# EAGLE design PCB-MicroAudio (EAGLE 7.7.0)

## Sheet 1 of 2
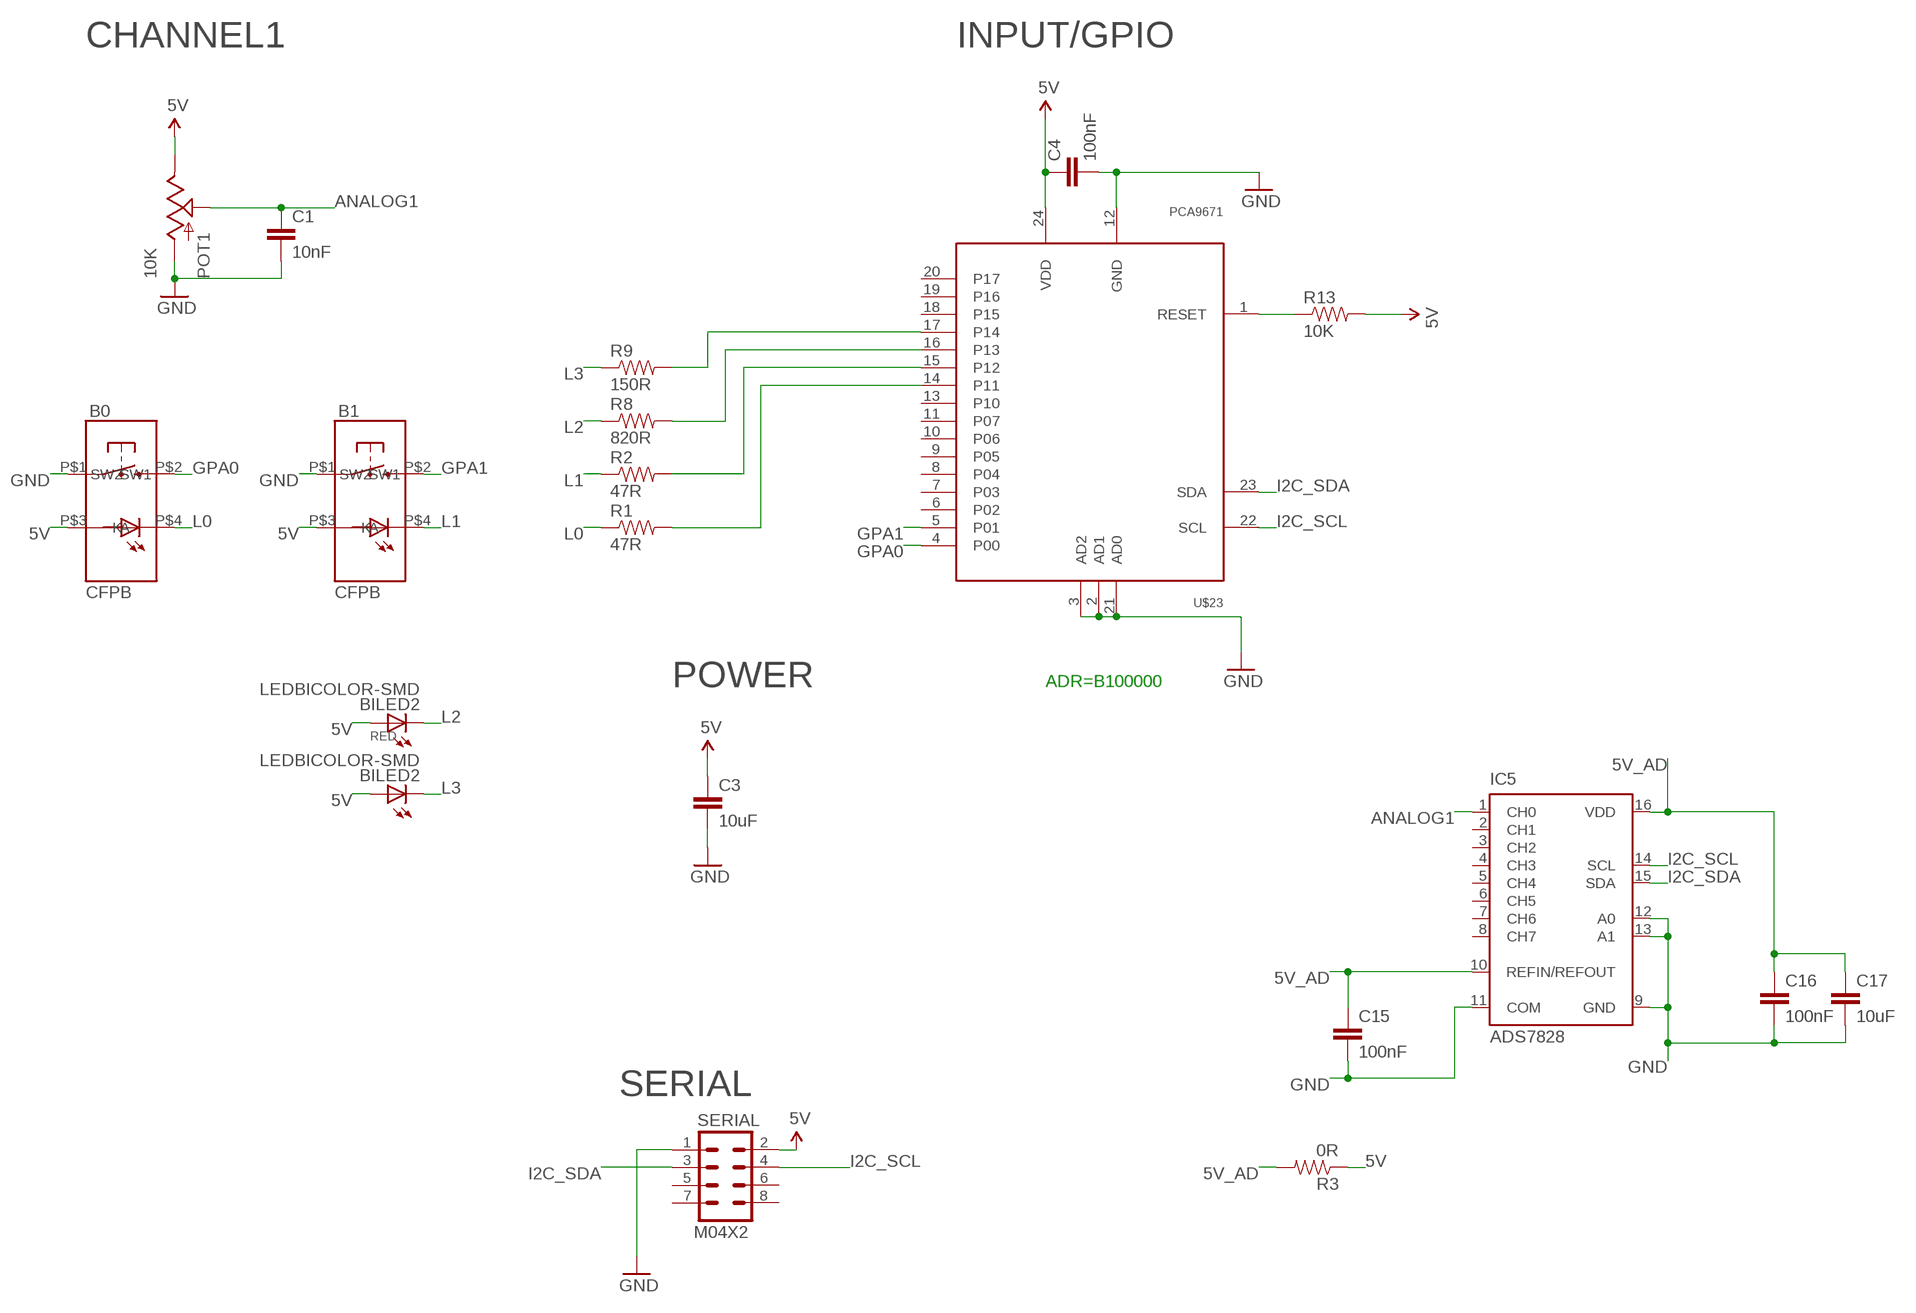
[diagram p0: schematic, sheet 1]

### Parts
B0  CFPB  [CFPB-6/9MM]
B1  CFPB  [CFPB-6/9MM]
BILED2  LEDBICOLOR-SMD  [LEDBICOLOR-SMD]
C1  10nF  CAP0603-CAP  [0603-CAP]
C3  10uF  CAP0805  [0805]
C4  100nF  CAP0603-CAP  [0603-CAP]
C15  100nF  CAP0603-CAP  [0603-CAP]
C16  100nF  CAP0603-CAP  [0603-CAP]
C17  10uF  CAP0805  [0805]
IC5  ADS7828  [TSSOP16-PW]
POT1  10K  POT  [ALPS_POT]
R1  47R  RESISTOR0603-RES  [0603-RES]
R2  47R  RESISTOR0603-RES  [0603-RES]
R3  0R  RESISTOR0603-RES  [0603-RES]
R8  820R  RESISTOR0603-RES  [0603-RES]
R9  150R  RESISTOR0603-RES  [0603-RES]
R13  10K  RESISTOR0603-RES  [0603-RES]
SERIAL  M04X2  [2X4]
U$23  PCA9671  [TSSOP24]

### Nets
5V [Power]: B0.P$3(A) B1.P$3(A) BILED2.P$1(A) BILED2.P$3(A1) C3.1 C4.1 POT1.P$1(E) R3.1 R13.2 SERIAL.2 U$23.24(VDD)
5V_AD [Power]: C15.1 C16.1 C17.1 IC5.10(REFIN/REFOUT) IC5.16(VDD) R3.2
ANALOG1: C1.1 IC5.1(CH0) POT1.P$2(S)
GND [Power]: B0.P$1(SW1) B1.P$1(SW1) C1.2 C3.2 C4.2 C15.2 C16.2 C17.2 IC5.9(GND) IC5.11(COM) IC5.12(A0) IC5.13(A1) POT1.P$3(A) SERIAL.1 U$23.2(AD1) U$23.3(AD2) U$23.12(GND) U$23.21(AD0)
GPA0: B0.P$2(SW2) U$23.4(P00)
GPA1: B1.P$2(SW2) U$23.5(P01)
I2C_SCL: IC5.14(SCL) SERIAL.4 U$23.22(SCL)
I2C_SDA: IC5.15(SDA) SERIAL.3 U$23.23(SDA)
L0: B0.P$4(K) R1.1
L1: B1.P$4(K) R2.1
L2: BILED2.P$2(C) R8.1
L3: BILED2.P$4(C1) R9.1
N$1: R9.2 U$23.17(P14)
N$6: R8.2 U$23.16(P13)
N$10: R2.2 U$23.15(P12)
N$11: R1.2 U$23.14(P11)
N$12: R13.1 U$23.1(RESET)
Unconnected: IC5.2(CH1) IC5.3(CH2) IC5.4(CH3) IC5.5(CH4) IC5.6(CH5) IC5.7(CH6) IC5.8(CH7) SERIAL.5 SERIAL.6 SERIAL.7 SERIAL.8 U$23.6(P02) U$23.7(P03) U$23.8(P04) U$23.9(P05) U$23.10(P06) U$23.11(P07) U$23.13(P10) U$23.18(P15) U$23.19(P16) U$23.20(P17)

### Notes on the sheet
- CHANNEL1 | INPUT/GPIO
- POWER | ADR=B100000
- SERIAL

## Sheet 2 of 2

## Library data of the parts
B0 B1 = SKAARHOJ:CFPB
BILED2 = SKAARHOJ:LEDBICOLOR-SMD
C1 C3 C4 C15-C17 = SparkFun:CAP: Capacitor Standard 0603 ceramic capacitor, and 0.1" leaded capacitor.
IC5 = burr-brown:ADS7828: 12-Bit, 8-Channel Sampling ANALOG-TO-DIGITAL CONVERTER with I2C? Interface Source: www.ti.com .. ADS7828.pdf; MF: TEXAS INSTRUMENTS; MPN: ADS7828E/250; OC_FARNELL: 1470338; OC_NEWARK: 74C7158
POT1 = SparkFun:POT
R1-R3 R8 R9 R13 = SparkFun:RESISTOR: Resistor Basic schematic elements and footprints for 0603, 1206, and PTH resistors.
SERIAL = SparkFun:M04X2
U$23 = SKAARHOJ:PCA9671

## Net classes
0 default: width 0.203 mm, drill 0.406 mm, clearance 0.203 mm
1 Power: width 0.406 mm, drill 0.61 mm, clearance 0.203 mm
2 Signal: width 0.152 mm, clearance 0.152 mm

## Board
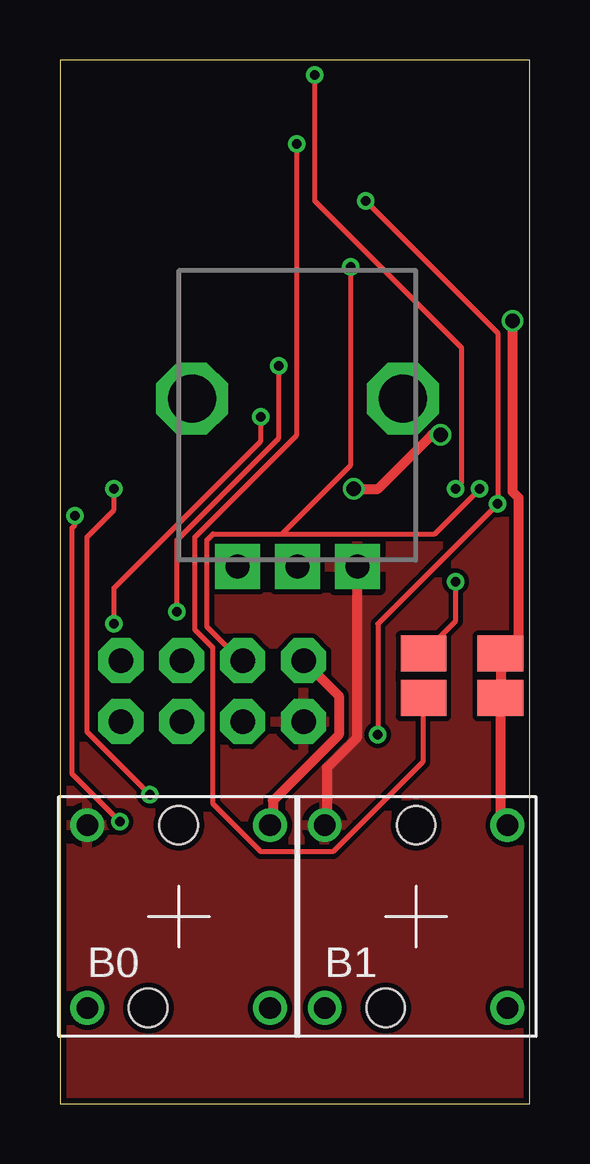
[diagram p1: board, top side]
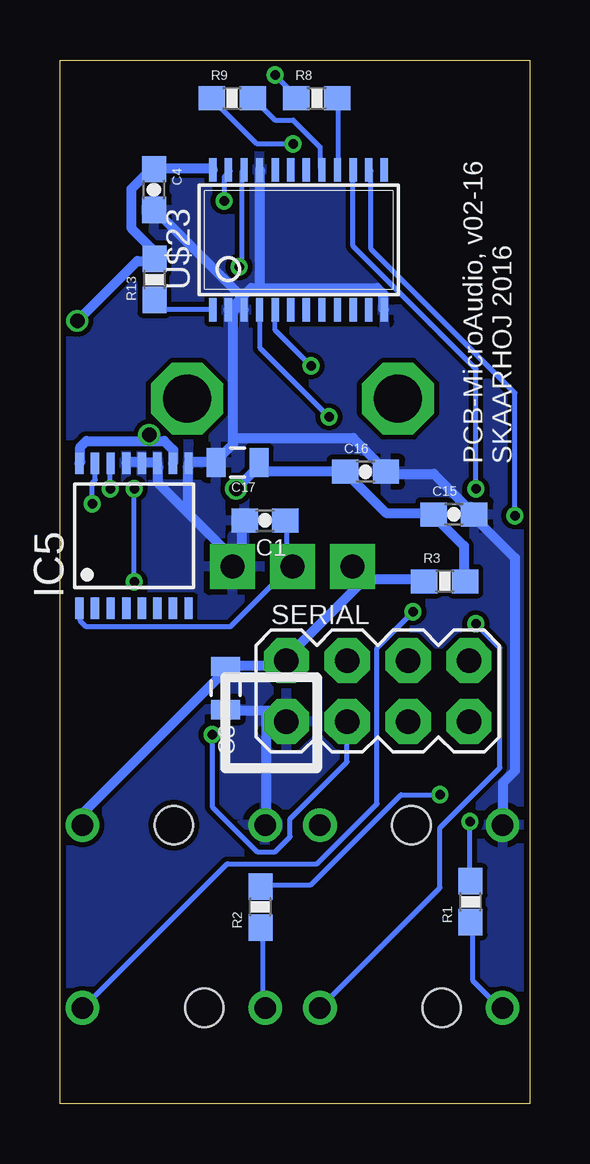
[diagram p2: board, bottom side, seen from below]

Size 19.6 x 43.5 mm. Coordinates in mm from the lower left corner, seen from the top.
Outline: 0,0 19.6,0 19.6,43.5 0,43.5 0,0
Copper layers (1*16): Top 0.035mm / dielectric 1.5mm / Bottom 0.035mm
Design rules "Fusion_eagle_rule_v1.1": minimum track width 6mil, minimum drill 12mil, track to track 6mil, track to pad 6mil, pad to pad 6mil, via to via 6mil, smd to smd 0mil, copper to edge 10mil, drill to drill 10mil, minimum pad ring 10mil, minimum via ring 6mil, stop-mask expansion 2mil, vias tented up to drill 100mil, thermal gap 10mil

### Footprints (pad centres in the part's own frame; a part is rotated, then mirrored left to right if it is on the bottom)
CFPB-6/9MM = drill 0.9: P$1 -3.81,3.81; P$2 3.81,-3.81; P$3 3.81,3.81; P$4 -3.81,-3.81 | hole 1.6: 0,3.81; -1.27,-3.81
LEDBICOLOR-SMD = smd 1.9 x 1.5: P$1 1.6,0.925; P$2 -1.6,0.925; P$3 1.6,-0.925; P$4 -1.6,-0.925
0603-CAP = smd 1.1 x 1: 1 -0.85,0; 2 0.85,0
0805 = smd 0.8 x 1.2: 1 -0.9,0; 2 0.9,0
TSSOP16-PW = smd 0.35 x 0.9: 1 -2.275,-3.025; 2 -1.625,-3.025; 3 -0.975,-3.025; 4 -0.325,-3.025; 5 0.325,-3.025; 6 0.975,-3.025; 7 1.625,-3.025; 8 2.275,-3.025; 9 2.275,3.025; 10 1.625,3.025; 11 0.975,3.025; 12 0.325,3.025; 13 -0.325,3.025; 14 -0.975,3.025; 15 -1.625,3.025; 16 -2.275,3.025
ALPS_POT = drill 1 pad 1.88 square: P$1 7,-2.5; P$2 7,0; P$3 7,2.5 | drill 2 octagon: P$4 0,-4.4; P$5 0,4.4
0603-RES = smd 1.1 x 1: 1 -0.85,0; 2 0.85,0
2X4 = drill 1.016 pad 1.88 octagon: 1 -3.81,-1.27; 2 -3.81,1.27; 3 -1.27,-1.27; 4 -1.27,1.27; 5 1.27,-1.27; 6 1.27,1.27; 7 3.81,-1.27; 8 3.81,1.27
TSSOP24 = smd 0.305 x 0.991: 1 -4.225,-2.918; 2 -3.575,-2.918; 3 -2.925,-2.918; 4 -2.275,-2.918; 5 -1.625,-2.918; 6 -0.975,-2.918; 7 -0.325,-2.918; 8 0.325,-2.918; 9 0.975,-2.918; 10 1.625,-2.918; 11 2.275,-2.918; 12 2.925,-2.918; 13 2.925,2.918; 14 2.275,2.918; 15 1.625,2.918; 16 0.975,2.918; 17 0.325,2.918; 18 -0.325,2.918; 19 -0.975,2.918; 20 -1.625,2.918; 21 -2.275,2.918; 22 -2.925,2.918; 23 -3.575,2.918; 24 -4.225,2.918

### Placement (x,y rotation side)
B0  4.95,7.79 0 top
B1  14.85,7.79 0 top
BILED2  16.76,17.83 0 top
C1  11.05,24.3 180 bottom
C3  12.7,17.32 270 bottom
C4  15.68,38.1 270 bottom
C15  3.17,24.56 0 bottom
C16  6.86,26.34 0 bottom
C17  12.19,26.72 180 bottom
IC5  16.51,23.67 0 bottom
POT1  9.9,29.39 270 top
R1  2.48,8.41 90 bottom
R2  11.24,8.19 90 bottom
R3  3.56,21.77 0 bottom
R8  8.89,41.9 0 bottom
R9  12.41,41.9 0 bottom
R13  15.65,34.35 90 bottom
SERIAL  6.35,17.19 0 bottom
U$23  9,36 0 bottom

### Tracks (layer width: path | path; a pad name or v marks a point on that pad's centre or on a via)
5V  (via drill 0.61)
  Top 0.406: B0.P$3 8.88,11.62 8.88,12.62 11.62,15.38 11.62,17 10.25,18.38 SERIAL.2 | B1.P$3 18.62,11.62 18.38,11.88 18.38,16.75 BILED2.P$3 18.38,17 18.38,18.75 BILED2.P$1 18.5,18.88 19.12,19.5 19.12,25.25 18.88,25.5 v18.88,32.62
  Bottom 0.406: R3.1 4.5,21.88 6.88,21.88 7.38,22.38 POT1.P$1 7,21.75 10.12,18.62 SERIAL.2 10.25,18.38 10.38,18.25 12.62,18.25 C3.1 12.88,18.12 12.88,17.88 18.62,12.12 18.62,11.62 B1.P$3 | U$23.24 13.25,39 15.62,39 C4.1 15.88,38.88 16.62,38.12 16.62,36.5 15.75,35.62 15.75,35.25 R13.2 15.88,35.12 16.38,35.12 v18.88,32.62
5V_AD  (via drill 0.61)
  Top 0.406: v15.88,27.88 15.5,27.88 13.25,25.62 v12.25,25.62
  Bottom 0.406: R3.2 2.75,21.88 2.75,23.25 4,24.5 C15.1 4.12,24.62 6,24.62 7.62,26.25 C16.1 7.75,26.38 11,26.38 11.25,26.62 C17.1 11.38,26.5 v12.25,25.62 | 15.88,27.62 18.5,27.62 18.75,27.38 18.75,26.75 IC5.16 | 15.88,27.62 15.25,27.62 14.88,27.25 14.88,26.75 IC5.10 | v15.88,27.88 15.88,27.62
ANALOG1
  Bottom 0.203: IC5.1 18.75,20.62 18.75,20.12 18.5,19.88 12.5,19.88 10,22.38 POT1.P$2 10.12,22.38 10.12,24.25 C1.1
GND
  Top 0.406: B1.P$1 11.12,11.62 11.12,14 12.38,15.25 12.38,22.38 POT1.P$3
  Bottom 0.406: B0.P$1 1.12,11.62 1.12,13.38 0.62,13.88 0.62,22.75 2.25,24.38 C15.2 2.38,24.62 4,26.25 6,26.25 C16.2 6.12,26.5 7.38,27.75 12.38,27.75 | 11.25,34 11.62,34 12,33.62 | 11.25,34 6.38,34 6.12,33.75 6.12,33.12 U$23.12 | 12.5,33.12 12.25,33.38 | 12.25,33.38 12,33.62 | 12.5,33.12 U$23.2 | U$23.3 12,33.12 12.25,33.38 | 11.25,34 11.25,38.88 U$23.21 | 12,33.62 15.62,37.25 C4.2 | C3.2 12.62,16.38 10.62,16.38 10.25,16 SERIAL.1 11,16.25 11,11.62 B1.P$1 | IC5.13 16.75,26.75 16.38,26.75 IC5.12 16.12,26.75 15.62,26.75 IC5.11 15.5,26.5 15.5,25.88 14.38,24.75 | C1.2 12,24.25 12,22.88 12.38,22.5 POT1.P$3 12.38,22.75 14.38,24.75 | 14.38,24.75 14.25,24.88 14.25,26.5 IC5.9 14.12,26.75 13.12,26.75 C17.2 13,26.88 12.38,27.5 12.38,27.75 | 12.38,27.75 12.38,33 12.5,33.12
  pour Bottom: 0,0 19.81,0 19.81,43.69 0,43.69
  pour Top: 0,0 19.81,0 19.81,43.56 0,43.56
GPA0  (via drill 0.41)
  Top 0.203: v8.38,28.62 8.38,27.62 2.25,21.5 v2.25,20
  Bottom 0.203: v8.38,28.62 11.25,31.5 11.25,33 U$23.4 | v2.25,20 1.25,19 1.25,14 3.75,11.5 3.75,9 8.75,4 B0.P$2
GPA1  (via drill 0.41)
  Top 0.203: v9.12,30.75 9.12,27.75 4.88,23.5 v4.88,20.5
  Bottom 0.203: U$23.5 10.62,32.25 v9.12,30.75 | v4.88,20.5 6.38,19 6.38,12.5 8.88,10 12.62,10 18.62,4 B1.P$2
I2C_SCL  (via drill 0.41)
  Top 0.203: v17.5,25.62 15.62,23.75 9.25,23.75 | 9.25,23.75 6.38,23.75 6.12,23.5 6.12,19.88 7.5,18.5 SERIAL.4 | v12.12,34.88 12.12,26.62 9.25,23.75
  Bottom 0.203: v17.5,25.62 17.5,26.62 IC5.14 | v12.12,34.88 12,35 12,38.88 U$23.22
I2C_SDA  (via drill 0.41)
  Top 0.203: v12.75,37.62 18.25,32.12 v18.25,25 13.25,20 v13.25,15.38
  Bottom 0.203: v18.25,25 18.25,25.88 18.12,26 18.12,26.62 IC5.15 | v12.75,37.62 12.75,38.62 12.5,38.88 U$23.23 | v13.25,15.38 13.25,12.38 11.38,10.5 10.62,10.5 10,11.12 10,11.88 7.62,14.25 7.62,15.88 SERIAL.3
L0
  Bottom 0.203: R1.1 2.38,7.5 2.38,5.12 1.25,4 B0.P$4
L1
  Bottom 0.203: R2.1 11.12,7.25 11.12,4 B1.P$4
L2  (via drill 0.41)
  Top 0.203: v10.62,42.88 10.62,37.62 16.75,31.5 16.75,25.88 v16.5,25.62 | v16.5,21.75 16.5,20.12 15.25,18.88 BILED2.P$2
  Bottom 0.203: v10.62,42.88 9.75,42 R8.1 | v16.5,21.75 v16.5,25.62
L3  (via drill 0.41)
  Top 0.203: v9.88,40 9.88,27.88 5.62,23.62 5.62,19.75 6.38,19 6.38,12.5 8.38,10.5 11.38,10.5 15.12,14.25 15.12,16.88 BILED2.P$4
  Bottom 0.203: v9.88,40 11.38,40 13.25,41.88 R9.1
N$1
  Bottom 0.203: U$23.17 8.75,39 8.75,39.88 9.88,41 10.62,41 11.5,41.88 R9.2
N$6
  Bottom 0.203: U$23.16 8,39 8,41.88 R8.2
N$10  (via drill 0.41)
  Top 0.203: v2.25,25.62 2.25,24.75 1.12,23.62 1.12,15.5 v3.75,12.88
  Bottom 0.203: U$23.15 7.38,35.75 2.25,30.62 v2.25,25.62 | v3.75,12.88 5.38,12.88 9.12,9.12 11.12,9.12 R2.2
N$11  (via drill 0.41)
  Top 0.203: v0.62,24.5 0.62,24.12 0.5,24 0.5,13.75 v2.5,11.75
  Bottom 0.203: v0.62,24.5 0.62,29.62 6.62,35.62 6.62,38.88 U$23.14 | v2.5,11.75 2.5,9.38 R1.2
N$12
  Bottom 0.203: U$23.1 13.25,33.12 15.25,33.12 15.62,33.5 R13.1

### Text on the board
_bsilk: PCB-MicroAudio, v02-16 / SKAARHOJ 2016